# Altium schematic sheet GR_actions.SchDoc
size A4
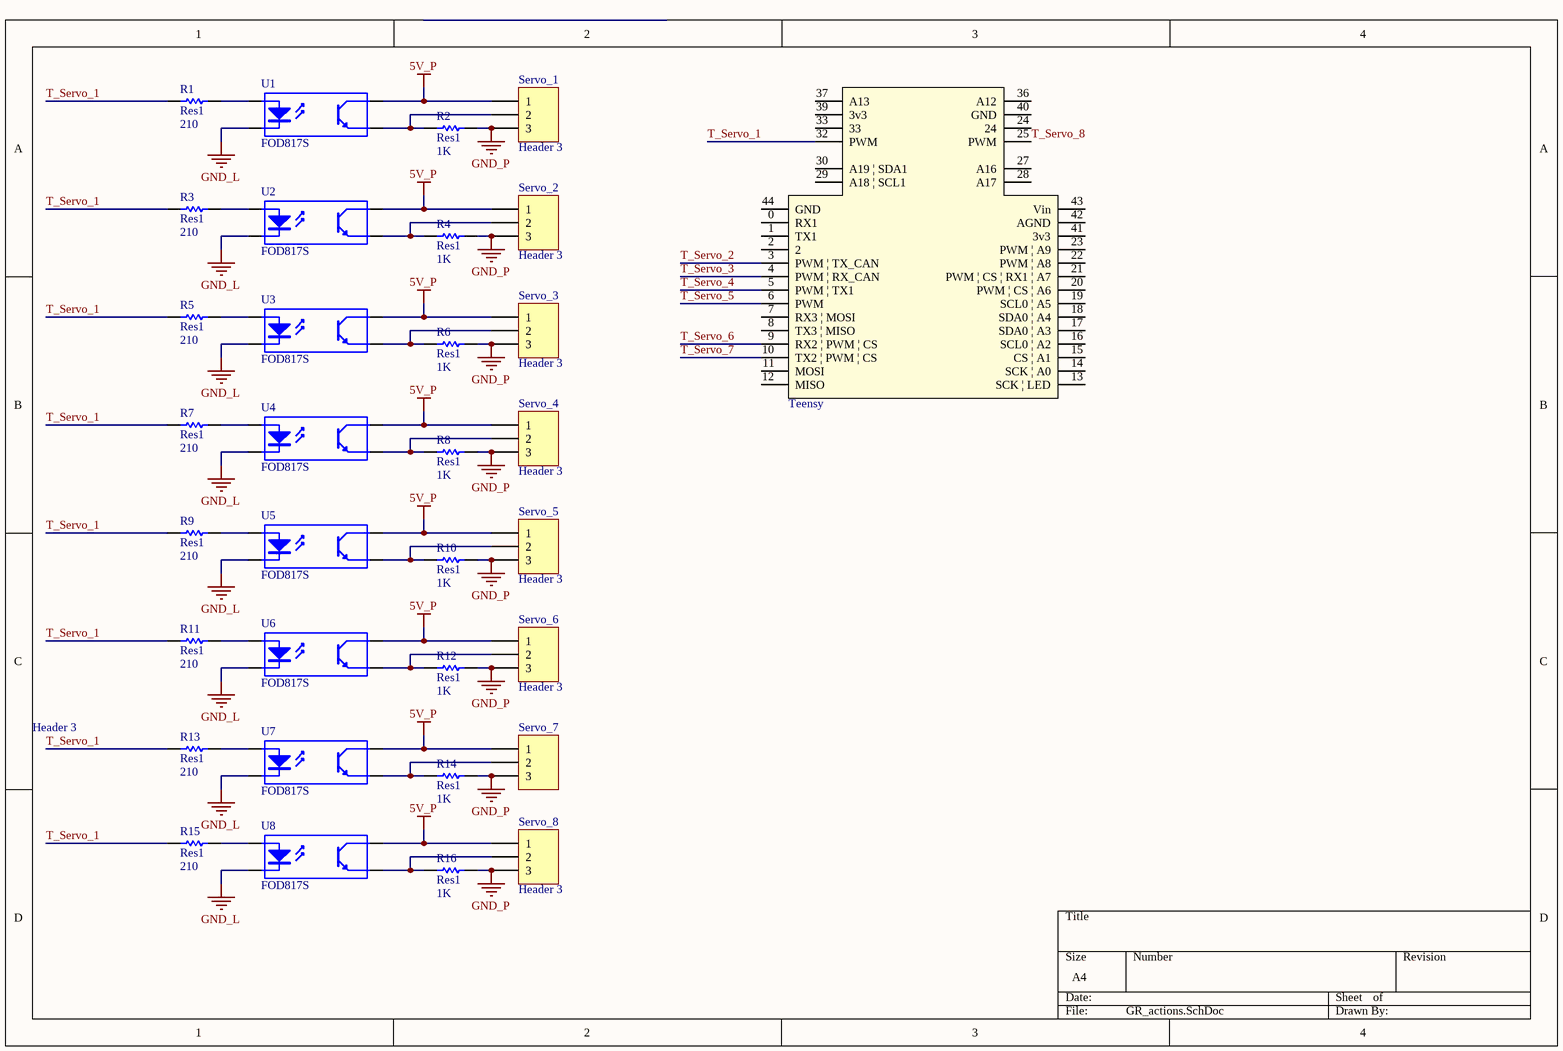
[diagram p0: GR_actions.SchDoc]

## Parts
R1  Res1  value 210  [Resistor 1206]
R2  Res1  value 1K  [Resistor 1206]
R3  Res1  value 210  [Resistor 1206]
R4  Res1  value 1K  [Resistor 1206]
R5  Res1  value 210  [Resistor 1206]
R6  Res1  value 1K  [Resistor 1206]
R7  Res1  value 210  [Resistor 1206]
R8  Res1  value 1K  [Resistor 1206]
R9  Res1  value 210  [Resistor 1206]
R10  Res1  value 1K  [Resistor 1206]
R11  Res1  value 210  [Resistor 1206]
R12  Res1  value 1K  [Resistor 1206]
R13  Res1  value 210  [Resistor 1206]
R14  Res1  value 1K  [Resistor 1206]
R15  Res1  value 210  [Resistor 1206]
R16  Res1  value 1K  [Resistor 1206]
Servo_1  Header 3  [S3B-XH-A]
Servo_2  Header 3  [S3B-XH-A]
Servo_3  Header 3  [S3B-XH-A]
Servo_4  Header 3  [S3B-XH-A]
Servo_5  Header 3  [S3B-XH-A]
Servo_6  Header 3  [S3B-XH-A]
Servo_7  Header 3  [S3B-XH-A]
Servo_8  Header 3  [S3B-XH-A]
Teensy  Teensy 3.2  [teensy_3,2_Base_Roulante]  (value not drawn)
U1  FOD817S  [SOP254P1016X385-4N]
U2  FOD817S  [SOP254P1016X385-4N]
U3  FOD817S  [SOP254P1016X385-4N]
U4  FOD817S  [SOP254P1016X385-4N]
U5  FOD817S  [SOP254P1016X385-4N]
U6  FOD817S  [SOP254P1016X385-4N]
U7  FOD817S  [SOP254P1016X385-4N]
U8  FOD817S  [SOP254P1016X385-4N]

## Nets
5V_P: Servo_1.1 Servo_2.1 Servo_3.1 Servo_4.1 Servo_5.1 Servo_6.1 Servo_7.1 Servo_8.1 U1.4(C) U2.4(C) U3.4(C) U4.4(C) U5.4(C) U6.4(C) U7.4(C) U8.4(C)
GND_L: U1.2(K) U2.2(K) U3.2(K) U4.2(K) U5.2(K) U6.2(K) U7.2(K) U8.2(K)
GND_P: R2.1 R4.1 R6.1 R8.1 R10.1 R12.1 R14.1 R16.1 Servo_1.3 Servo_2.3 Servo_3.3 Servo_4.3 Servo_5.3 Servo_6.3 Servo_7.3 Servo_8.3
T_Servo_1: R1.2 R3.2 R5.2 R7.2 R9.2 R11.2 R13.2 R15.2 Teensy.32(PWM)
T_Servo_2: Teensy.3(PWM_|_TX_CAN)
T_Servo_3: Teensy.4(PWM_|_RX_CAN)
T_Servo_4: Teensy.5(PWM_|_TX1)
T_Servo_5: Teensy.6(PWM)
T_Servo_6: Teensy.9(RX2_|_PWM_|_CS)
T_Servo_7: Teensy.10(TX2_|_PWM_|_CS)
T_Servo_8: Teensy.25(PWM)
NetR1_1: R1.1 U1.1(A)
NetR2_2: R2.2 Servo_1.2 U1.3(E)
NetR3_1: R3.1 U2.1(A)
NetR4_2: R4.2 Servo_2.2 U2.3(E)
NetR5_1: R5.1 U3.1(A)
NetR6_2: R6.2 Servo_3.2 U3.3(E)
NetR7_1: R7.1 U4.1(A)
NetR8_2: R8.2 Servo_4.2 U4.3(E)
NetR9_1: R9.1 U5.1(A)
NetR10_2: R10.2 Servo_5.2 U5.3(E)
NetR11_1: R11.1 U6.1(A)
NetR12_2: R12.2 Servo_6.2 U6.3(E)
NetR13_1: R13.1 U7.1(A)
NetR14_2: R14.2 Servo_7.2 U7.3(E)
NetR15_1: R15.1 U8.1(A)
NetR16_2: R16.2 Servo_8.2 U8.3(E)

Not connected (* = marked no-connect by the designer): Teensy 0(RX1) 1(TX1) 2 7(RX3_|_MOSI) 8(TX3_|_MISO) 11(MOSI) 12(MISO) 13(SCK_|_LED) 14(SCK_|_A0) 15(CS_|_A1) 16(SCL0_|_A2) 17(SDA0_|_A3) 18(SDA0_|_A4) 19(SCL0_|_A5) 20(PWM_|_CS_|_A6) 21(PWM_|_CS_|_RX1_|_A7) 22(PWM_|_A8) 23(PWM_|_A9) 24 27(A16) 28(A17) 29(A18_|_SCL1) 30(A19_|_SDA1) 33 36(A12) 37(A13) 39(3v3) 40(GND) 41(3v3) 42(AGND) 43(Vin) 44(GND)

## Library data of the parts
R1-R16 = Res1: Resistor; Published: 8-Jun-2000; LatestRevisionDate: 17-Jul-2002; LatestRevisionNote: Re-released for DXP Platform.; PackageReference: AXIAL-0.3; Publisher: Altium Limited; PackageDescription: Axial Device, Thru-Hole; 2 Leads; 0.3 in Pin Spacing
Servo_1-Servo_8 = Header 3: Header, 3-Pin; LatestRevisionDate: 17-Jul-2002; LatestRevisionNote: Re-released for DXP Platform.; Publisher: Altium Limited
Teensy = teensy3.2_Base_Roulante
U1-U8 = Optoisolator1: 4-Pin Phototransistor Optocoupler; Published: 24-Mar-1999; LatestRevisionDate: 04-Mar-2005; LatestRevisionNote: Sch pins 3 & 4 Swapped.; DatasheetVersion: Nov-2003; PackageReference: DIP-4; Publisher: Altium Limited